# EAGLE design xiao mx (EAGLE 9.5.2)
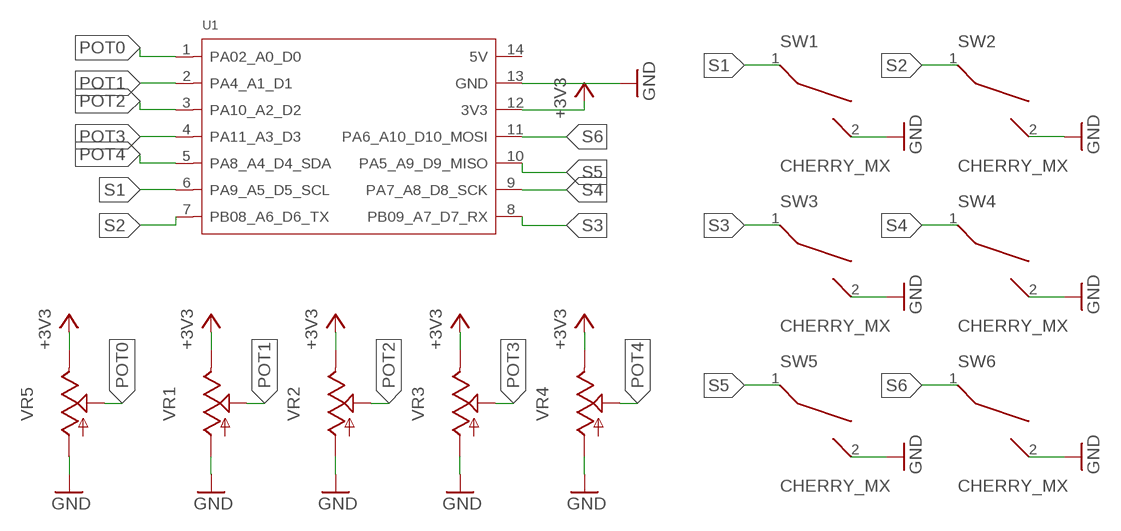
[diagram p0: schematic, sheet 1]

## Parts
SW1  CHERRY_MX  [MX1A-XXNN]
SW2  CHERRY_MX  [MX1A-XXNN]
SW3  CHERRY_MX  [MX1A-XXNN]
SW4  CHERRY_MX  [MX1A-XXNN]
SW5  CHERRY_MX  [MX1A-XXNN]
SW6  CHERRY_MX  [MX1A-XXNN]
U1  MOUDLE-SEEEDUINO-XIAO  [MOUDLE14P-2.54-21X17.8MM]
VR1  9MM_SNAP-IN_POT_  [9MM_SNAP-IN_POT]
VR2  9MM_SNAP-IN_POT_  [9MM_SNAP-IN_POT]
VR3  9MM_SNAP-IN_POT_  [9MM_SNAP-IN_POT]
VR4  9MM_SNAP-IN_POT_  [9MM_SNAP-IN_POT]
VR5  9MM_SNAP-IN_POT_  [9MM_SNAP-IN_POT]

## Nets
+3V3: U1.12(3V3) VR1.3(E) VR2.3(E) VR3.3(E) VR4.3(E) VR5.3(E)
GND: SW1.2 SW2.2 SW3.2 SW4.2 SW5.2 SW6.2 U1.13(GND) VR1.1(A) VR2.1(A) VR3.1(A) VR4.1(A) VR5.1(A)
POT0: U1.1(PA02_A0_D0) VR5.2(S)
POT1: U1.2(PA4_A1_D1) VR1.2(S)
POT2: U1.3(PA10_A2_D2) VR2.2(S)
POT3: U1.4(PA11_A3_D3) VR3.2(S)
POT4: U1.5(PA8_A4_D4_SDA) VR4.2(S)
S1: SW1.1 U1.6(PA9_A5_D5_SCL)
S2: SW2.1 U1.7(PB08_A6_D6_TX)
S3: SW3.1 U1.8(PB09_A7_D7_RX)
S4: SW4.1 U1.9(PA7_A8_D8_SCK)
S5: SW5.1 U1.10(PA5_A9_D9_MISO)
S6: SW6.1 U1.11(PA6_A10_D10_MOSI)
Unconnected: U1.14(5V)

## Library data of the parts
SW1-SW6 = Cherry_MX_v7.0:CHERRY_MX
U1 = Seeeduino XIAO:MOUDLE-SEEEDUINO-XIAO
VR1-VR5 = MusicThingModular:9MM_SNAP-IN_POT: 9mm vertical snap-in pot, Alpha / Panasonic style

## Board
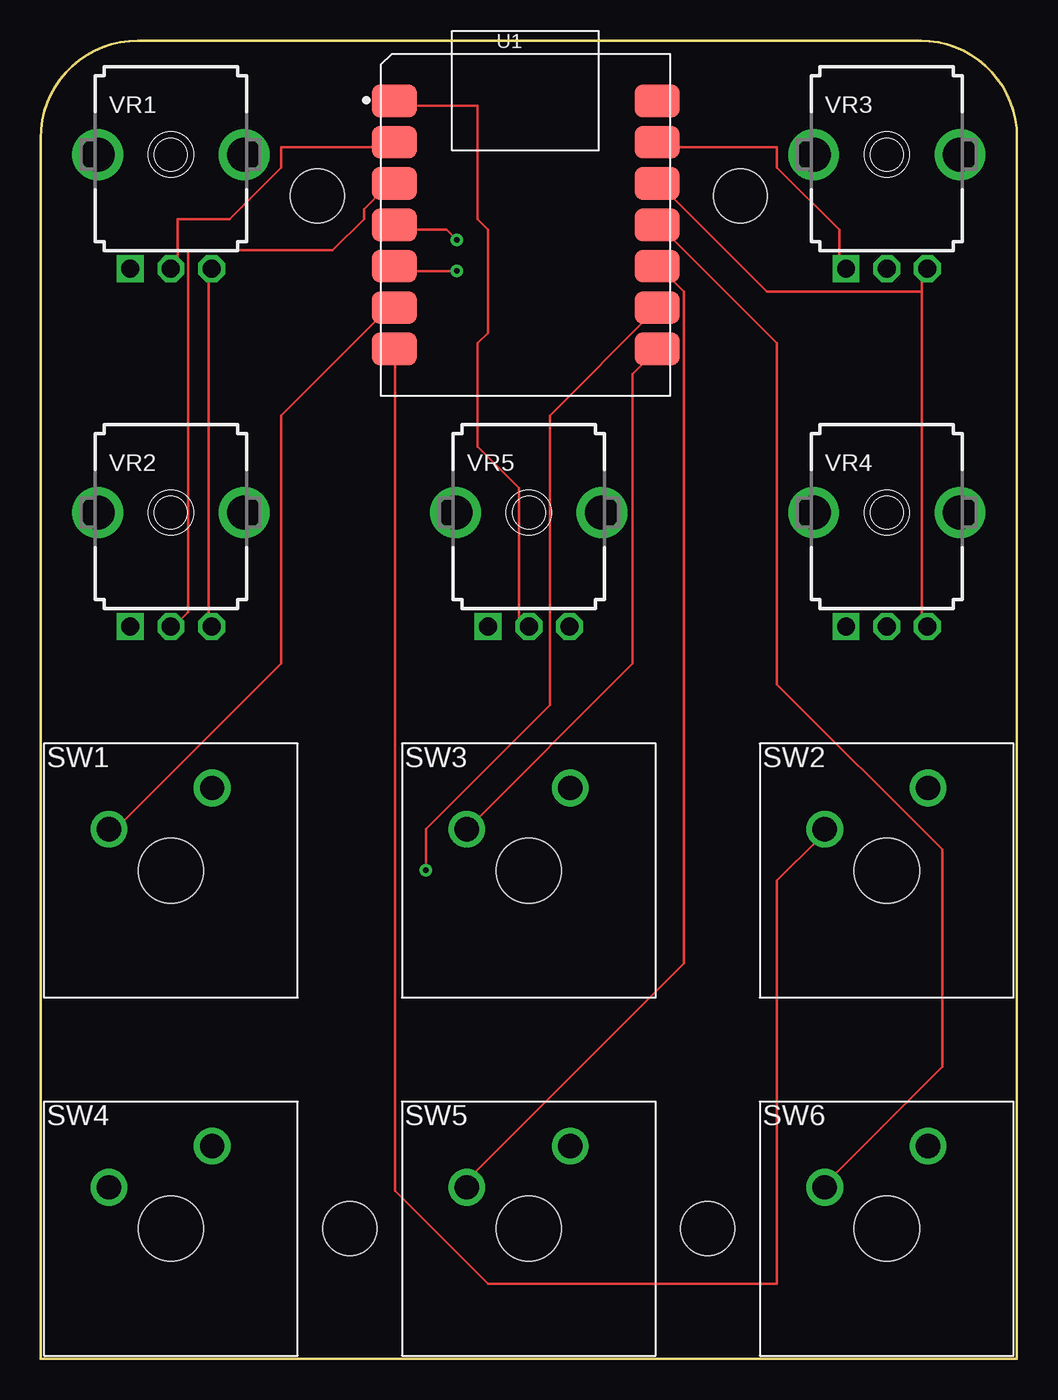
[diagram p1: board, top side]
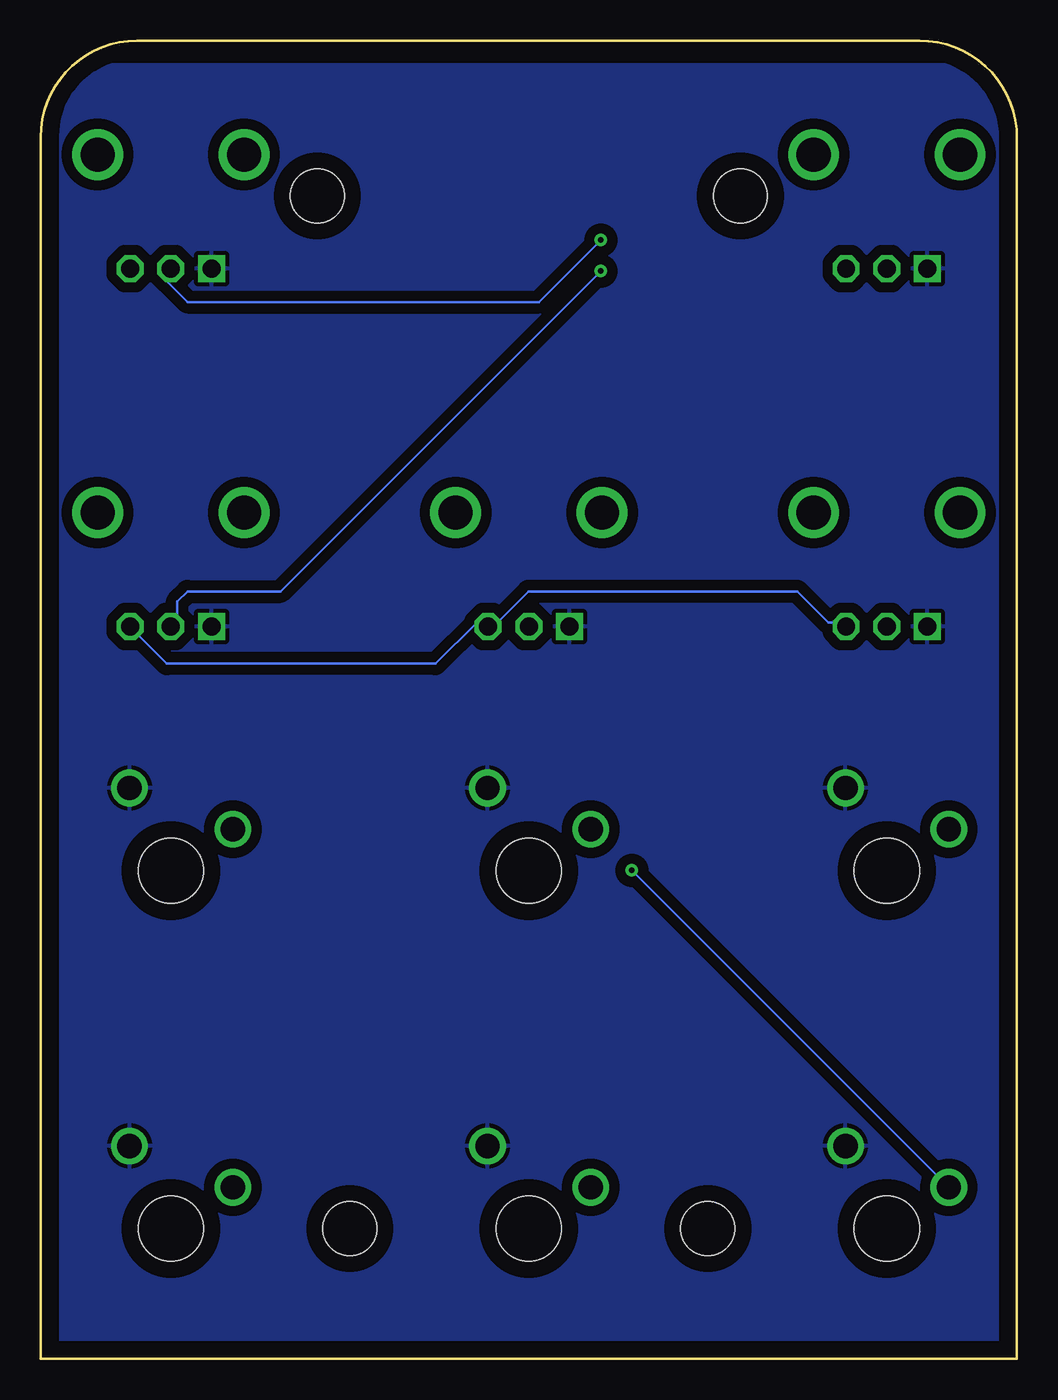
[diagram p2: board, bottom side, seen from below]

Size 60 x 81 mm. Coordinates in mm from the lower left corner, seen from the top.
Outline: 60,0 60,75.08 arc90 54.08,81 5.99,81 arc90 0,75.01 0,0 60,0
Copper layers (1*16): Top 0.035mm / dielectric 1.5mm / Bottom 0.035mm
Design rules "default": minimum track width 6mil, minimum drill 0.35mm, track to track 6mil, track to pad 6mil, pad to pad 6mil, via to via 6mil, smd to smd 6mil, copper to edge 40mil, drill to drill 6mil, minimum pad ring 10mil, minimum via ring 8mil, stop-mask expansion 4mil, vias tented up to drill 0mil, thermal gap 10mil
Holes 3.3 mm at 19,8 41,8 43,71.46 17,71.46

### Footprints (pad centres in the part's own frame; a part is rotated, then mirrored left to right if it is on the bottom)
MX1A-XXNN = drill 1.5: 1 -3.81,2.54; 2 2.54,5.08 | hole 4: 0,0
MOUDLE14P-2.54-21X17.8MM = smd 2.75 x 2: 1 0.835,18.12; 2 0.835,15.58; 3 0.835,13.04; 4 0.835,10.5; 5 0.835,7.96; 6 0.835,5.42; 7 0.835,2.88; 8 17,2.88; 9 17,5.42; 10 17,7.96; 11 17,10.5; 12 17,13.04; 13 17,15.58; 14 17,18.12
9MM_SNAP-IN_POT = drill 1.1 square: 1 -2.5,-7 | drill 1.1 octagon: 2 0,-7; 3 2.5,-7 | drill 2.1 pad 2.794: CHASSIS1 -4.5,0; CHASSIS2 4.5,0

### Placement (x,y rotation side)
SW1  8,30 0 top
SW2  52,30 0 top
SW3  30,30 0 top
SW4  8,8 0 top
SW5  30,8 0 top
SW6  52,8 0 top
U1  20.9,59.18 0 top
VR1  8,74 0 top
VR2  8,52 0 top
VR3  52,74 0 top
VR4  52,52 0 top
VR5  30,52 0 top

### Tracks (layer width: path | path; a pad name or v marks a point on that pad's centre or on a via)
+3V3
  Top 0.152: 54.15,65.58 44.62,65.58 38.27,71.93 U1.12 | 54.15,65.58 54.15,66.85 VR3.3 | 54.15,65.58 54.15,45.26 VR4.3 | VR2.3 10.33,45.26 10.33,66.85 VR1.3
  Bottom 0.152: VR2.3 10.97,45.26 11.6,45.26 13.51,47.16 30.02,47.16 31.92,45.26 VR5.3 32.56,45.26 33.19,45.26 35.73,42.72 52.24,42.72 54.15,44.62 VR4.3
GND
  Top 0.152: U1.13 38.27,74.47 45.26,74.47 45.26,73.2 49.07,69.39 49.07,67.48 VR3.1
  pour Bottom (isolate 0.635): 0.81,79.55 59.23,79.55 59.23,0.81 0.81,0.81
POT0
  Top 0.152: U1.1 21.76,77.01 26.84,77.01 26.84,70.02 27.48,69.39 27.48,63.04 26.84,62.4 26.84,56.05 29.38,53.51 29.38,45.26 VR5.2
POT1
  Top 0.152: U1.2 21.13,74.47 14.78,74.47 14.78,73.2 11.6,70.02 8.43,70.02 8.43,67.48 VR1.2
POT2
  Top 0.152: U1.3 21.13,71.93 19.86,70.66 19.86,70.02 17.95,68.12 9.06,68.12 9.06,45.89 8.43,45.26 VR2.2
POT3  (via drill 0.35)
  Top 0.152: v25.57,68.75 24.94,69.39 21.76,69.39 U1.4
  Bottom 0.152: v25.57,68.75 29.38,64.94 50.97,64.94 52.24,66.21 52.24,66.85 VR3.2
POT4  (via drill 0.35)
  Top 0.152: v25.57,66.85 21.76,66.85 U1.5
  Bottom 0.152: v25.57,66.85 45.26,47.16 50.97,47.16 51.61,46.53 51.61,45.26 VR4.2
S1
  Top 0.152: U1.6 21.13,64.31 14.78,57.96 14.78,42.72 4.62,32.56 SW1.1
S2
  Top 0.152: U1.7 21.76,61.77 21.76,10.33 27.48,4.62 45.26,4.62 45.26,29.38 47.8,31.92 SW2.1
S3
  Top 0.152: SW3.1 36.37,42.72 36.37,60.5 37.64,61.77 U1.8
S4  (via drill 0.35)
  Top 0.152: v23.67,30.02 23.67,32.56 31.29,40.18 31.29,57.96 37.64,64.31 U1.9
  Bottom 0.152: SW4.1 v23.67,30.02
S5
  Top 0.152: U1.10 38.27,66.85 39.54,65.58 39.54,24.3 26.21,10.97 SW5.1
S6
  Top 0.152: U1.11 38.27,69.39 45.26,62.4 45.26,41.45 55.42,31.29 55.42,17.95 48.43,10.97 SW6.1